# EasyEDA schematic 2.json
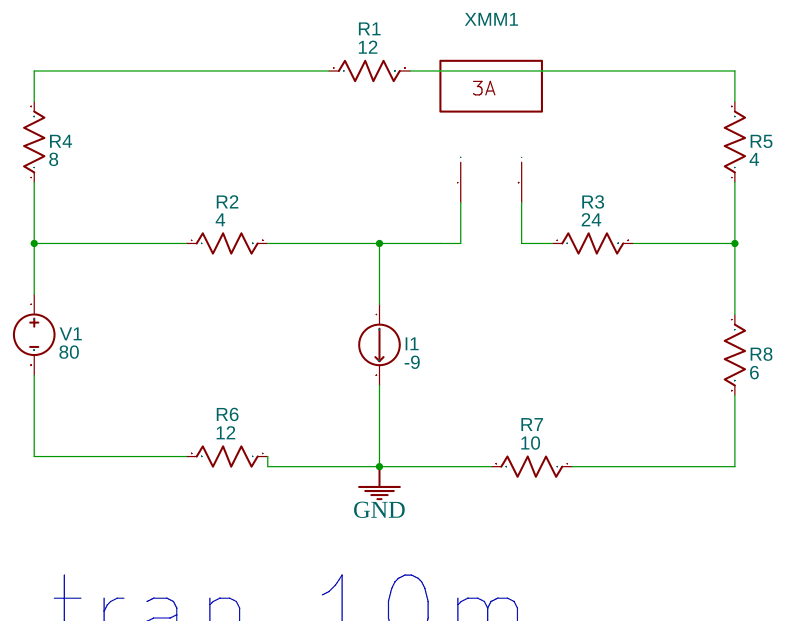
[diagram p0: schematic sheet]

## Parts
I1  -9  [2P-5.08]
R1  12  [AXIAL-0.3]
R2  4  [AXIAL-0.3]
R3  24  [AXIAL-0.3]
R4  8  [AXIAL-0.3]
R5  4  [AXIAL-0.3]
R6  12  [AXIAL-0.3]
R7  10  [AXIAL-0.3]
R8  6  [AXIAL-0.3]
V1  80  [HDR1X2]
XMM1  Multimeter

## Library data of the parts
I1 = IDC: Contributor: EasyEDA; sim: true
R1-R8 = Resistor_US: Resistance: 1k; Contributor: EasyEDA; Supplier: YUJING
V1 = VDC: Contributor: EasyEDA; sim: true
XMM1 = MULTIMETER: Supplier: LCSC; Multimeter Type: Amper; Power Type: AC; Voltmeter resistance: 10μ; Ammeter resistance: 1G; NameDisplay: 0; Contributor: EasyEDA; sim: true

## Nets
GND: I1.2 R6.1 R7.2
Net-(I1-1): I1.1 R2.2 XMM1.1(+)
Net-(R1-1): R1.1 R4.2
Net-(R1-2): R1.2 R5.2
Net-(R2-1): R2.1 R4.1 V1.1
Net-(R3-1): R3.1 XMM1.2(I)
Net-(R3-2): R3.2 R5.1 R8.1
Net-(R6-2): R6.2 V1.2
Net-(R7-1): R7.1 R8.2

## Notes on the sheet
- .tran 10m
